# Altium schematic sheet 2020年电赛校赛接口板.SchDoc
size A4; DocumentNumber: 4; Revision: V2.0; SheetNumber: 4; SheetTotal: 5
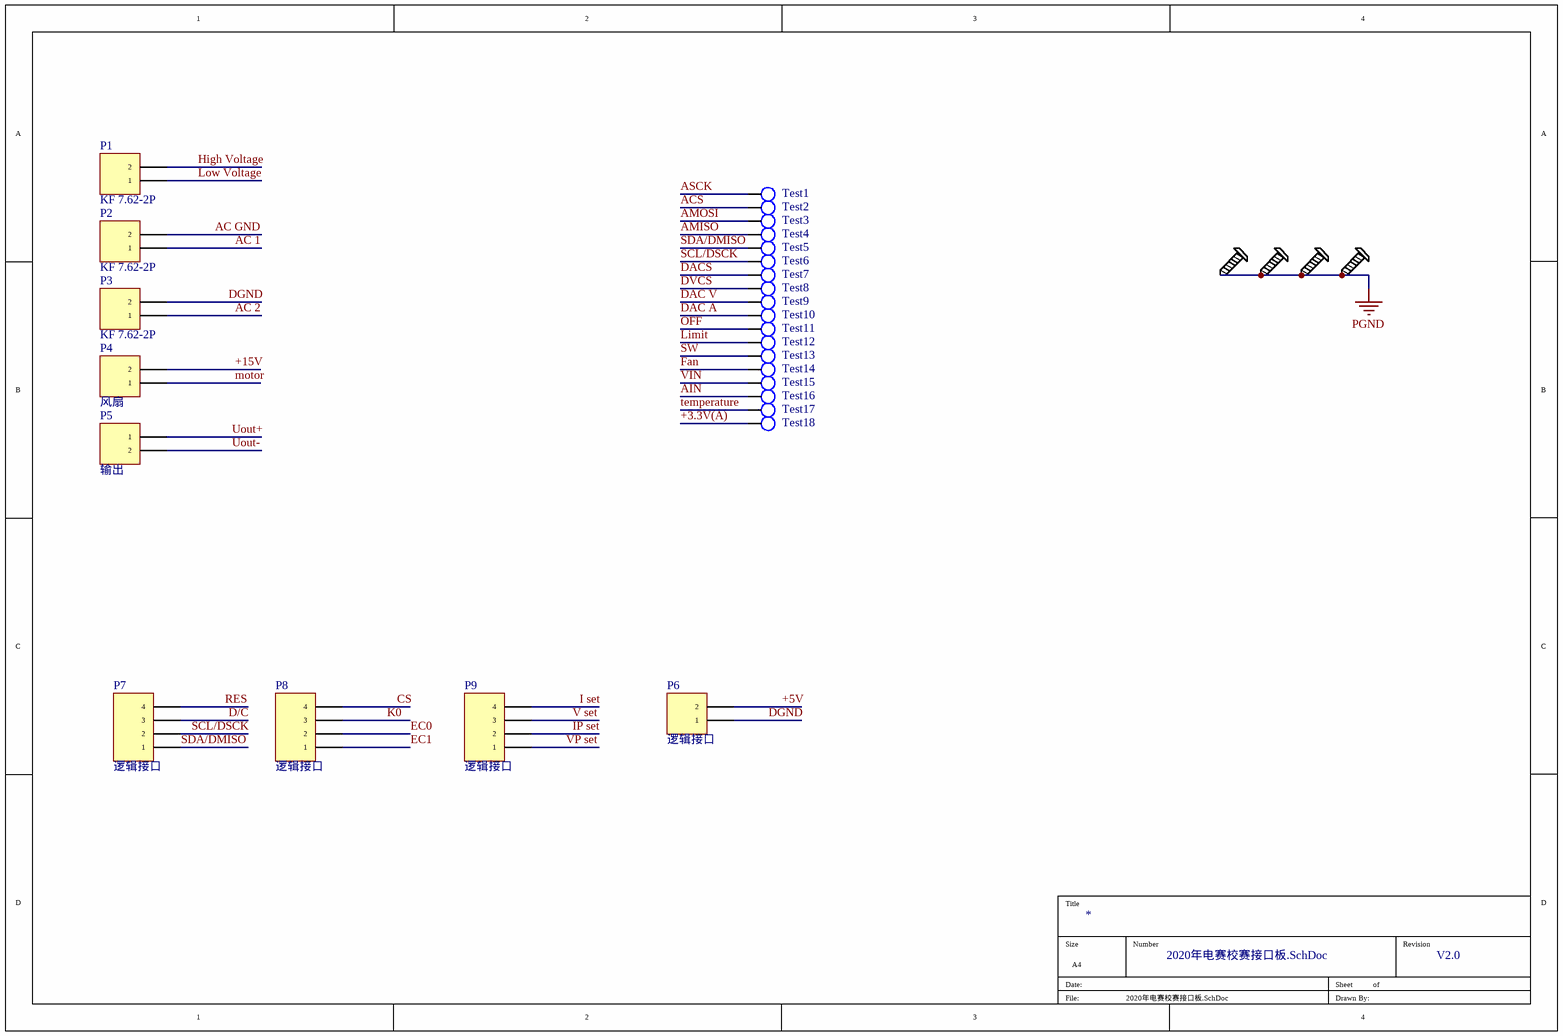
[diagram p0: 2020年电赛校赛接口板.SchDoc]

## Parts
P1  KF 7.62-2P  [KF7.62-2P]
P2  KF 7.62-2P  [KF7.62-2P]
P3  KF 7.62-2P  [KF7.62-2P]
P4  风扇  [XH2.54-2P]
P5  输出  [KF7.62-2P]
P6  逻辑接口  [XH2.54-2P]
P7  逻辑接口  [XH2.54-4P]
P8  逻辑接口  [XH2.54-4P]
P9  逻辑接口  [XH2.54-4P]
S2  M3铜柱  [M3x4+6_L]  (value not drawn)
S3  M3铜柱  [M3x4+6_L]  (value not drawn)
S4  M3铜柱  [M3x4+6_L]  (value not drawn)
S5  M3铜柱  [M3x4+6_L]  (value not drawn)
Test1  测试点  [point]  (value not drawn)
Test2  测试点  [point]  (value not drawn)
Test3  测试点  [point]  (value not drawn)
Test4  测试点  [point]  (value not drawn)
Test5  测试点  [point]  (value not drawn)
Test6  测试点  [point]  (value not drawn)
Test7  测试点  [point]  (value not drawn)
Test8  测试点  [point]  (value not drawn)
Test9  测试点  [point]  (value not drawn)
Test10  测试点  [point]  (value not drawn)
Test11  测试点  [point]  (value not drawn)
Test12  测试点  [point]  (value not drawn)
Test13  测试点  [point]  (value not drawn)
Test14  测试点  [point]  (value not drawn)
Test15  测试点  [point]  (value not drawn)
Test16  测试点  [point]  (value not drawn)
Test17  测试点  [point]  (value not drawn)
Test18  测试点  [point]  (value not drawn)

## Nets
PGND: S2.1(GND) S3.1(GND) S4.1(GND) S5.1(GND)
+3.3V(A): Test18.1(测试点)
+5V: P6.2
+15V: P4.2
AC 1: P2.1
AC 2: P3.1
AC GND: P2.2
ACS: Test2.1(测试点)
AIN: Test16.1(测试点)
AMISO: Test4.1(测试点)
AMOSI: Test3.1(测试点)
ASCK: Test1.1(测试点)
CS: P8.4
D/C: P7.3
DAC A: Test10.1(测试点)
DAC V: Test9.1(测试点)
DACS: Test7.1(测试点)
DGND: P3.2 P6.1
DVCS: Test8.1(测试点)
EC0: P8.2
EC1: P8.1
Fan: Test14.1(测试点)
High Voltage: P1.2
I set: P9.4
IP set: P9.2
K0: P8.3
Limit: Test12.1(测试点)
Low Voltage: P1.1
motor: P4.1
OFF: Test11.1(测试点)
RES: P7.4
SCL/DSCK: P7.2 Test6.1(测试点)
SDA/DMISO: P7.1 Test5.1(测试点)
SW: Test13.1(测试点)
temperature: Test17.1(测试点)
Uout+: P5.1
Uout-: P5.2
V set: P9.3
VIN: Test15.1(测试点)
VP set: P9.1

## Library data of the parts
P1-P6 = Header 2: Header, 2-Pin; LatestRevisionDate: 17-Jul-2002; LatestRevisionNote: Re-released for DXP Platform.; Publisher: Altium Limited
P7-P9 = Header 4: Header, 4-Pin; LatestRevisionDate: 17-Jul-2002; LatestRevisionNote: Re-released for DXP Platform.; Publisher: Altium Limited